# Altium schematic sheet Revisions.SchDoc: Capacitive Sensor Board
size A4; DrawnBy: Coen de Boer; Engineer: Coen de Boer; Revision: 2015-H
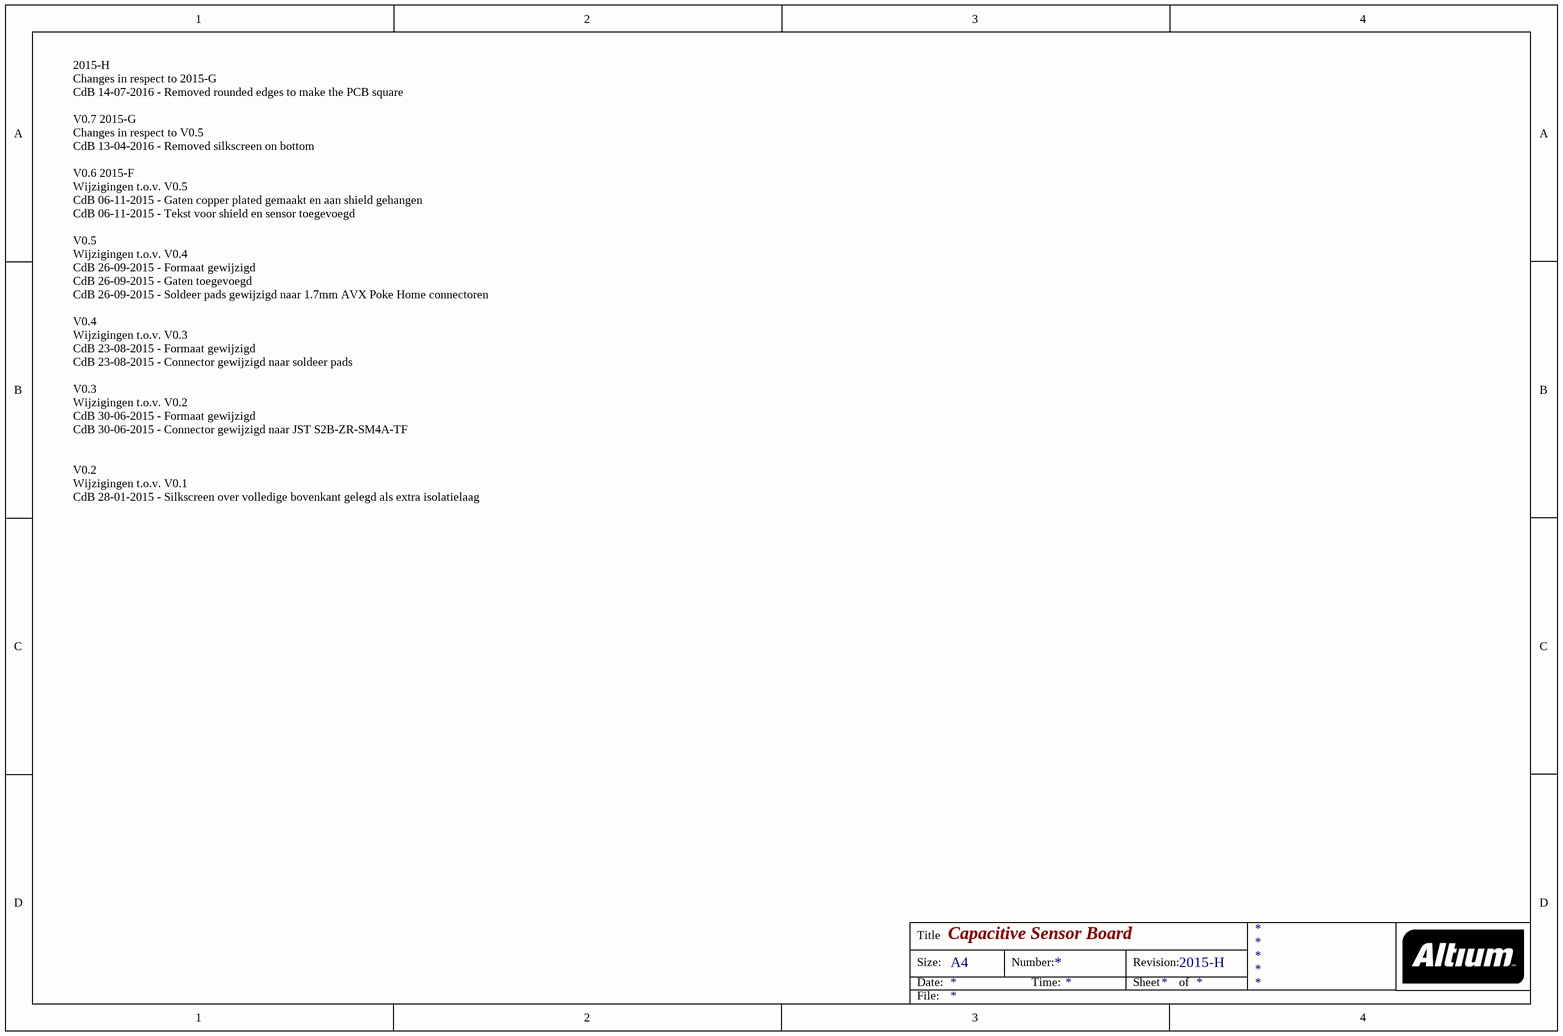
[diagram p0: Revisions.SchDoc]

## Notes on the sheet
- 2015-H
  Changes in respect to 2015-G
  CdB 14-07-2016 - Removed rounded edges to make the PCB square
  V0.7 2015-G
  Changes in respect to V0.5
  CdB 13-04-2016 - Removed silkscreen on bottom
  V0.6 2015-F
  Wijzigingen t.o.v. V0.5
  CdB 06-11-2015 - Gaten copper plated gemaakt en aan shield gehangen
  CdB 06-11-2015 - Tekst voor shield en sensor toegevoegd
  V0.5
  Wijzigingen t.o.v. V0.4
  CdB 26-09-2015 - Formaat gewijzigd
  CdB 26-09-2015 - Gaten toegevoegd
  CdB 26-09-2015 - Soldeer pads gewijzigd naar 1.7mm AVX Poke Home connectoren
  V0.4
  Wijzigingen t.o.v. V0.3
  CdB 23-08-2015 - Formaat gewijzigd
  CdB 23-08-2015 - Connector gewijzigd naar soldeer pads
  V0.3
  Wijzigingen t.o.v. V0.2
  CdB 30-06-2015 - Formaat gewijzigd
  CdB 30-06-2015 - Connector gewijzigd naar JST S2B-ZR-SM4A-TF
  V0.2
  Wijzigingen t.o.v. V0.1
  CdB 28-01-2015 - Silkscreen over volledige bovenkant gelegd als extra isolatielaag
- Title
- Size:
- Date:
- A4
- Number:
- Time:
- Revision:
- Sheet
- of
- File: